# Altium schematic sheet Kapasitor Kart v1.0.SchDoc
size A4
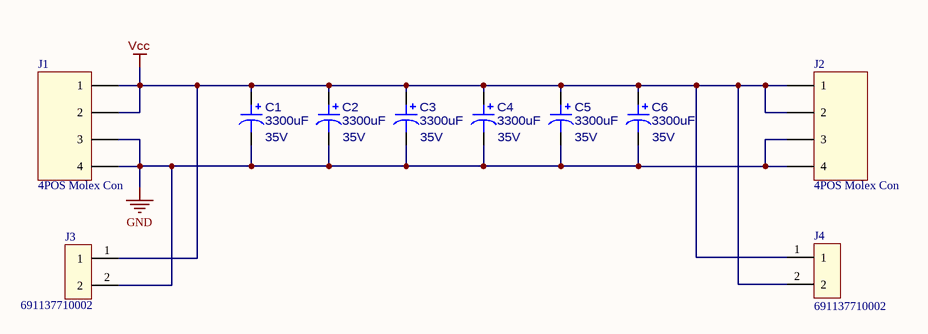
[diagram p0: Kapasitor Kart v1.0.SchDoc]

## Parts
C1  3300uF  Volt: 35V  [TH/C/7.50mm]
C2  3300uF  Volt: 35V  [TH/C/7.50mm]
C3  3300uF  Volt: 35V  [TH/C/7.50mm]
C4  3300uF  Volt: 35V  [TH/C/7.50mm]
C5  3300uF  Volt: 35V  [TH/C/7.50mm]
C6  3300uF  Volt: 35V  [TH/C/7.50mm]
J1  4POS Molex Con  [87438-0443]
J2  4POS Molex Con  [87438-0443]
J3  691137710002  [691137710002]
J4  691137710002  [691137710002]

## Nets
GND: C1.2 C2.2 C3.2 C4.2 C5.2 C6.2 J1.3 J1.4 J2.3 J2.4 J3.2
Vcc: C1.1 C2.1 C3.1 C4.1 C5.1 C6.1 J1.1 J1.2 J2.1 J2.2 J3.1 J4.1 J4.2

## Library data of the parts
C1-C6 = AlumCap: PKR3-035V332MJ250; Value: 3300uF; Mfr No: PKR3-035V332MJ250; Supplier Link: https://www.ozdisan.com/pasif-komponentler/kondansatorler/aluminyum-kondansatorler/PKR3-035V332MJ250; ComponentLink1Description: Supplier Link; ComponentLink1URL: https://www.ozdisan.com/pasif-komponentler/kondansatorler/aluminyum-kondansatorler/PKR3-035V332MJ250
J1 J2 = 87438-0443: 4 CKT 1.5mm HDR. Rt.-Angle SMT; ComponentLink1Description: Mouser Link; ComponentLink1URL: https://www.mouser.com.tr/ProductDetail/Molex/87438-0443?qs=IOh0O5QtZ911kd24EQ6lAA==; Mouser No: 538-87438-0443; Mfr No: 87438-0443; Digikey Link: https://www.digikey.com/en/products/detail/molex/0874380443/699148; ComponentLink2Description: Digikey Link; ComponentLink2URL: https://www.digikey.com/en/products/detail/molex/0874380443/699148
J3 J4 = 691137710002: 2 Position Wire to Board Terminal Block Horizontal with Board 0.197" (5.00mm) Through Hole; ComponentLink1Description: Digikey Link; ComponentLink1URL: https://www.digikey.com/en/products/detail/w%C3%BCrth-elektronik/691137710002/6644051; Mfr No: 691137710002; Digikey No: 732-10955-ND; Digikey Link: https://www.digikey.com/en/products/detail/w%C3%BCrth-elektronik/691137710002/6644051